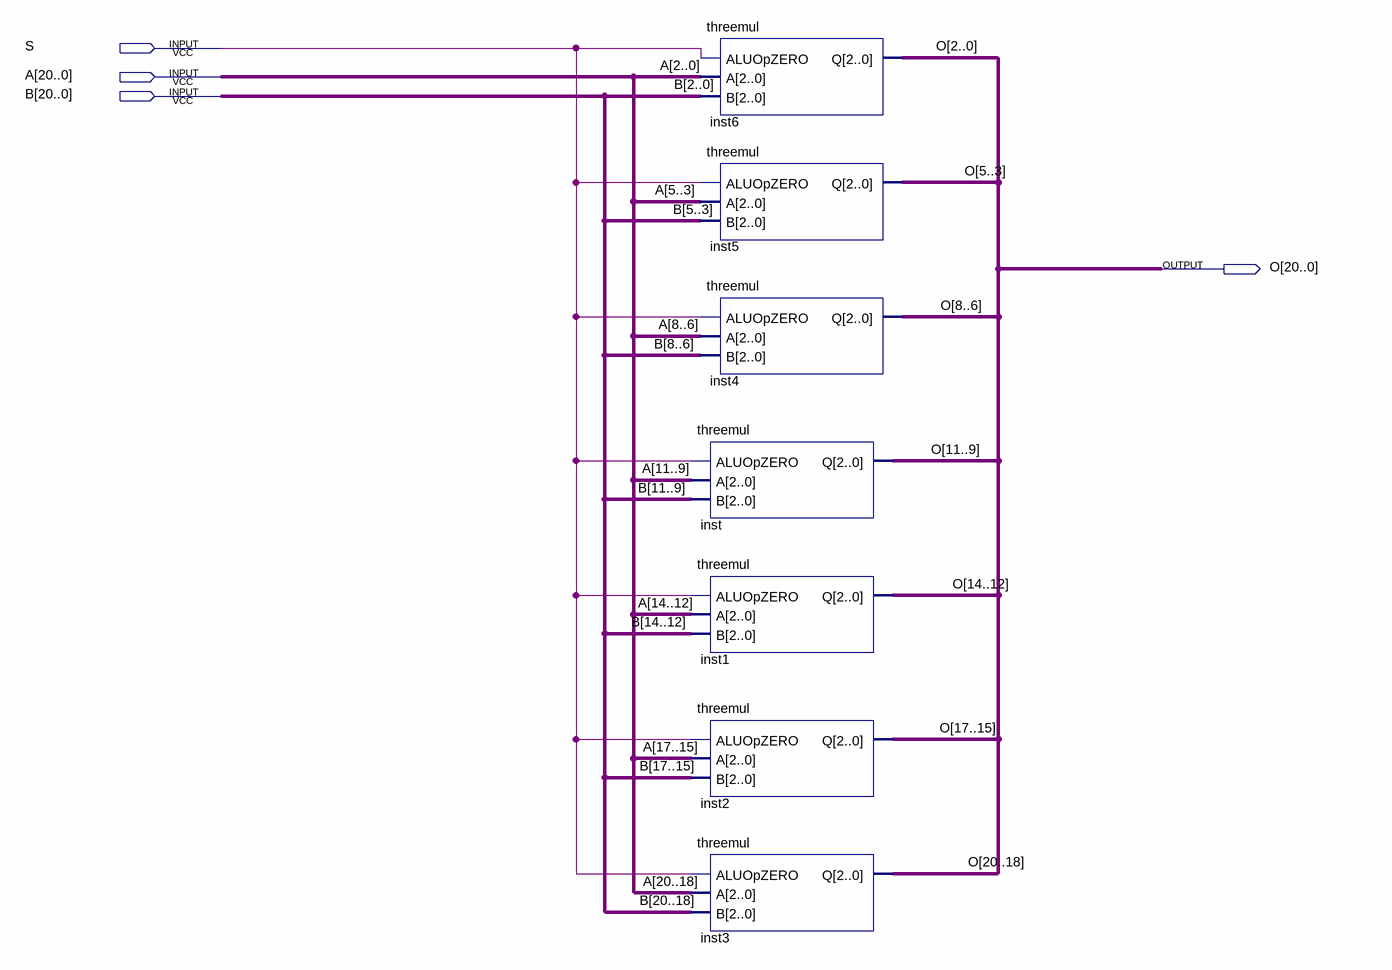
[diagram p0: schematic sheet]
// Quartus schematic twoonemulti.bdf as structural Verilog: 7 symbols, 4 pins
module twoonemulti (
  input  S,
  input  [20:0] A,
  input  [20:0] B,
  output [20:0] O
);

  threemul inst6 (.ALUOpZERO(S), .A(A[2:0]), .B(B[2:0]), .Q(O[2:0]));
  threemul inst5 (.ALUOpZERO(S), .A(A[5:3]), .B(B[5:3]), .Q(O[5:3]));
  threemul inst4 (.ALUOpZERO(S), .A(A[8:6]), .B(B[8:6]), .Q(O[8:6]));
  threemul inst (.ALUOpZERO(S), .A(A[11:9]), .B(B[11:9]), .Q(O[11:9]));
  threemul inst1 (.ALUOpZERO(S), .A(A[14:12]), .B(B[14:12]), .Q(O[14:12]));
  threemul inst2 (.ALUOpZERO(S), .A(A[17:15]), .B(B[17:15]), .Q(O[17:15]));
  threemul inst3 (.ALUOpZERO(S), .A(A[20:18]), .B(B[20:18]), .Q(O[20:18]));
endmodule
